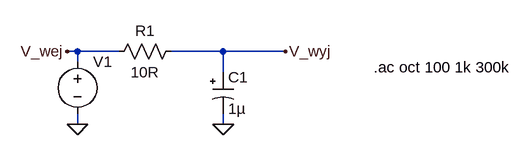
[diagram p0: schematic lowpass.asc]
lowpass.asc, the LTspice schematic file:
Version 4
SHEET 1 880 680
WIRE -48 128 -64 128
WIRE 16 128 -48 128
WIRE 176 128 96 128
WIRE 272 128 176 128
WIRE -48 144 -48 128
WIRE 176 160 176 128
WIRE -48 240 -48 224
WIRE 176 240 176 224
FLAG 176 240 0
FLAG 272 128 V_wyj
FLAG -64 128 V_wej
FLAG -48 240 0
SYMBOL res 112 112 R90
WINDOW 0 0 56 VBottom 2
WINDOW 3 32 56 VTop 2
SYMATTR InstName R1
SYMATTR Value 10R
SYMBOL polcap 160 160 R0
WINDOW 3 24 56 Left 2
SYMATTR Value 1µ
SYMATTR InstName C1
SYMATTR Description Capacitor
SYMATTR Type cap
SYMATTR SpiceLine V=16 Irms=0 Rser=0 Lser=0
SYMBOL voltage -48 128 R0
WINDOW 3 24 96 Invisible 2
WINDOW 39 0 0 Left 0
SYMATTR Value 5
SYMATTR InstName V1
SYMATTR Value2 AC 1
TEXT 408 152 Left 2 !.ac oct 100 1k 300k

The netlist it stands for:
* lowpass.asc
R1 V_wyj V_wej 10R
C1 V_wyj 0 1µ V=16 Irms=0 Rser=0 Lser=0
V1 V_wej 0 5 AC 1
.ac oct 100 1k 300k
.backanno
.end

* Results of the author's LTspice run, read from the files saved beside the schematic
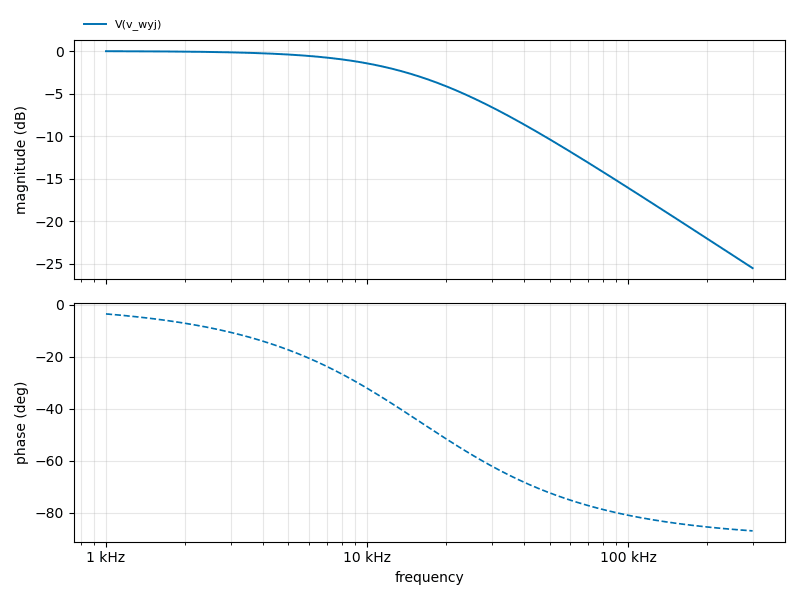
[diagram p1: AC Analysis of lowpass.asc, plotted from the saved traces]
* AC Analysis, 1 run:
*   V(v_wyj): -0.02 dB at 1 kHz, -25.52 dB at 300 kHz, peak -0.02 dB at 1 kHz, 3 dB below the peak at 15.98 kHz